# EAGLE schematic am_overview (EAGLE 6.3)
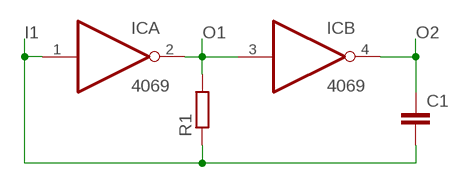
[diagram p0: schematic, sheet 1]

## Parts
C1  C-EU025-024X044  [C025-024X044]
IC  4069  4069N  [DIL14]
R1  R-EU_0204/2V  [0204V]

## Nets
N$1: IC.2(A:O) IC.3(B:I) R1.2
N$3: C1.1 IC.4(B:O)
N$4: C1.2 IC.1(A:I) R1.1
Unconnected: IC.5(C:I) IC.6(C:O) IC.8(D:O) IC.9(D:I) IC.10(E:O) IC.11(E:I) IC.12(F:O) IC.13(F:I)

## Notes on the sheet
- I1 | O1 | O2

## Power pins joined to a net without a drawn wire
VDD: IC.14(P:VDD)
VSS: IC.7(P:VSS)

## Library data of the parts
C1 = resistor:C-EU: CAPACITOR, European symbol
IC = 40xx:4069: Hex INVERTER
R1 = resistor:R-EU_: RESISTOR, European symbol